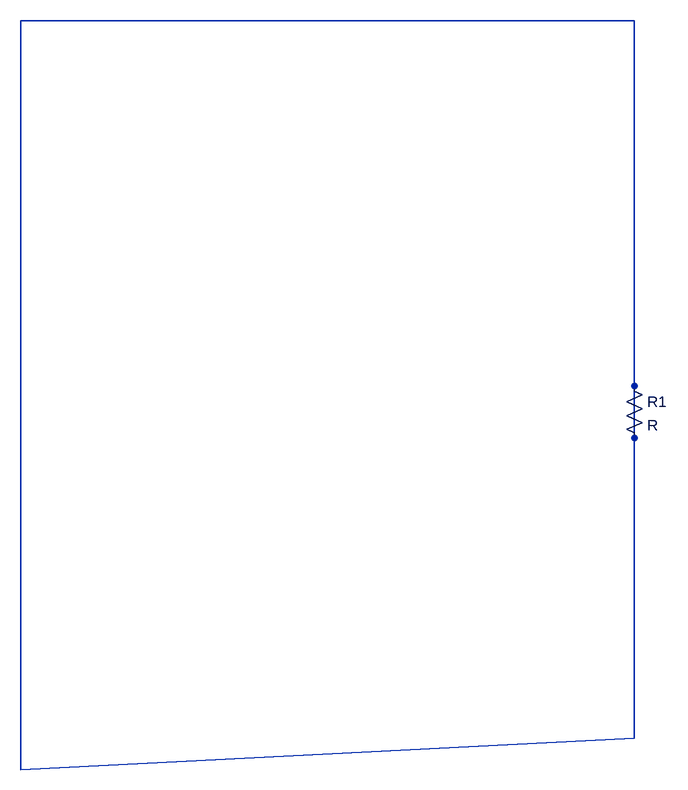
[diagram p0: schematic ltspice_data.asc]
ltspice_data.asc, the LTspice schematic file:
Version 4
SHEET 1 880 680
SYMBOL res 2144 1522 R0
SYMATTR InstName R1
WIRE 2160 976 2160 2080
WIRE 1216 2128 2160 2080
WIRE 1216 976 2160 976
WIRE 1216 976 1216 2128

The netlist it stands for:
* ltspice_data.asc
R1 N001 N001 R
.backanno
.end